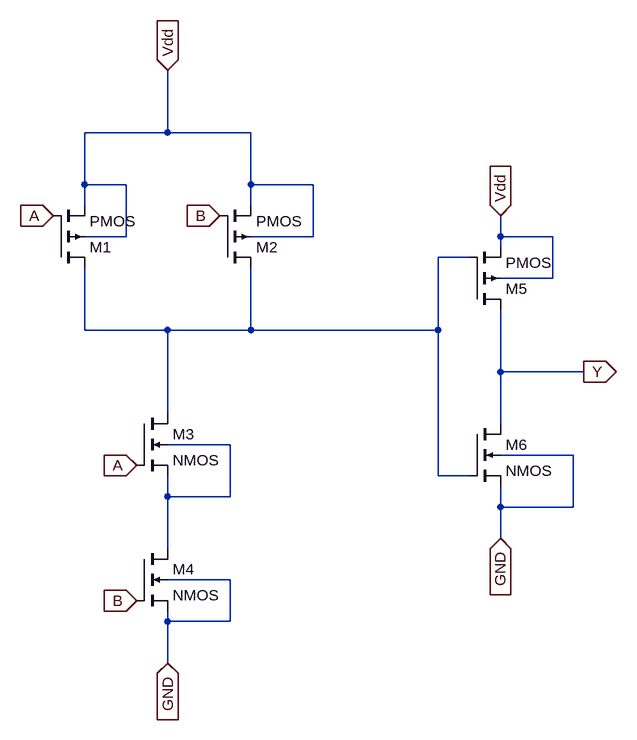
[diagram p0: schematic AND.asc]
AND.asc, the LTspice schematic file:
Version 4
SHEET 1 1140 880
WIRE 304 -48 304 -144
WIRE 304 -48 176 -48
WIRE 432 -48 304 -48
WIRE 176 32 176 -48
WIRE 240 32 176 32
WIRE 432 32 432 -48
WIRE 528 32 432 32
WIRE 176 64 176 32
WIRE 432 64 432 32
WIRE 240 112 240 32
WIRE 240 112 176 112
WIRE 528 112 528 32
WIRE 528 112 432 112
WIRE 816 112 816 80
WIRE 896 112 816 112
WIRE 816 128 816 112
WIRE 768 144 720 144
WIRE 896 176 896 112
WIRE 896 176 816 176
WIRE 176 256 176 160
WIRE 304 256 176 256
WIRE 432 256 432 160
WIRE 432 256 304 256
WIRE 720 256 720 144
WIRE 720 256 432 256
WIRE 816 320 816 224
WIRE 944 320 816 320
WIRE 304 384 304 256
WIRE 816 400 816 320
WIRE 400 432 304 432
WIRE 928 448 816 448
WIRE 720 480 720 256
WIRE 768 480 720 480
WIRE 304 512 304 480
WIRE 400 512 400 432
WIRE 400 512 304 512
WIRE 816 528 816 496
WIRE 928 528 928 448
WIRE 928 528 816 528
WIRE 816 576 816 528
WIRE 304 592 304 512
WIRE 400 640 304 640
WIRE 304 704 304 688
WIRE 400 704 400 640
WIRE 400 704 304 704
WIRE 304 768 304 704
FLAG 304 -144 Vdd
IOPIN 304 -144 In
FLAG 128 80 A
IOPIN 128 80 In
FLAG 384 80 B
IOPIN 384 80 In
FLAG 256 464 A
IOPIN 256 464 In
FLAG 256 672 B
IOPIN 256 672 In
FLAG 816 80 Vdd
IOPIN 816 80 In
FLAG 944 320 Y
IOPIN 944 320 Out
FLAG 816 576 GND
IOPIN 816 576 In
FLAG 304 768 GND
IOPIN 304 768 In
SYMBOL pmos4 128 160 M180
SYMATTR InstName M1
SYMBOL pmos4 384 160 M180
SYMATTR InstName M2
SYMBOL nmos4 256 384 R0
SYMATTR InstName M3
SYMBOL nmos4 256 592 R0
SYMATTR InstName M4
SYMBOL pmos4 768 224 M180
SYMATTR InstName M5
SYMBOL nmos4 768 400 R0
SYMATTR InstName M6

The netlist it stands for:
* AND.asc
M1 N001 A Vdd Vdd PMOS
M2 N001 B Vdd Vdd PMOS
M3 N001 A N002 N002 NMOS
M4 N002 B GND GND NMOS
M5 Y N001 Vdd Vdd PMOS
M6 Y N001 GND GND NMOS
.model NMOS NMOS
.model PMOS PMOS
.lib standard.mos
.backanno
.end